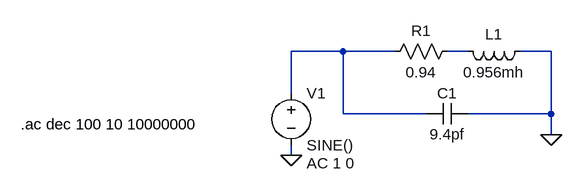
[diagram p0: schematic Draft1.asc]
Draft1.asc, the LTspice schematic file:
Version 4
SHEET 1 880 680
WIRE 16 96 -64 96
WIRE 96 96 16 96
WIRE 208 96 176 96
WIRE 336 96 288 96
WIRE -64 160 -64 96
WIRE 16 192 16 96
WIRE 144 192 16 192
WIRE 336 192 336 96
WIRE 336 192 208 192
WIRE 336 224 336 192
WIRE -64 256 -64 240
FLAG 336 224 0
FLAG -64 256 0
SYMBOL ind 304 80 R90
WINDOW 0 5 56 VBottom 2
WINDOW 3 32 56 VTop 2
SYMATTR InstName L1
SYMATTR Value 0.956mh
SYMBOL cap 208 176 R90
WINDOW 0 0 32 VBottom 2
WINDOW 3 32 32 VTop 2
SYMATTR InstName C1
SYMATTR Value 9.4pf
SYMBOL res 192 80 R90
WINDOW 0 0 56 VBottom 2
WINDOW 3 32 56 VTop 2
SYMATTR InstName R1
SYMATTR Value 0.94
SYMBOL voltage -64 144 R0
WINDOW 123 24 124 Left 2
WINDOW 39 0 0 Left 0
SYMATTR InstName V1
SYMATTR Value SINE()
SYMATTR Value2 AC 1 0
TEXT -480 208 Left 2 !.ac dec 100 10 10000000

The netlist it stands for:
* Draft1.asc
L1 0 N002 0.956mh
C1 0 N001 9.4pf
R1 N002 N001 0.94
V1 N001 0 SINE() AC 1 0
.ac dec 100 10 10000000
.backanno
.end